# Altium schematic sheet ProExtBus.SchDoc
size A
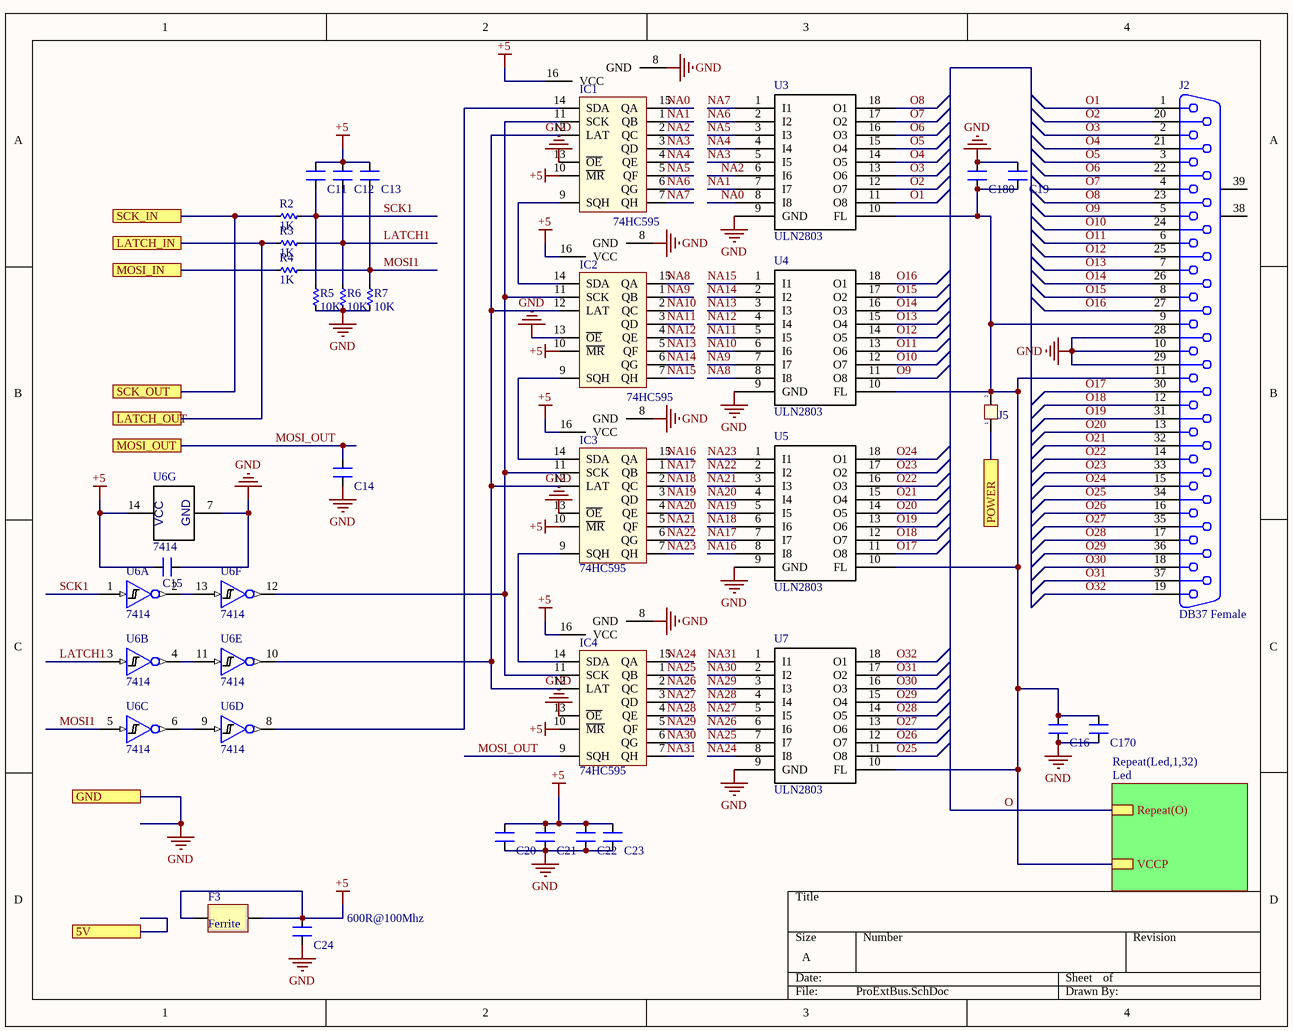
[diagram p0: ProExtBus.SchDoc]

## Parts
C11  1nF  [CN-SMD-0603_big]  (value not drawn)
C12  1nF  [CN-SMD-0603_big]  (value not drawn)
C13  1nF  [CN-SMD-0603_big]  (value not drawn)
C14  1nF  [CN-SMD-0603_big]  (value not drawn)
C15  CN  [CN-SMD-0603_big]  (value not drawn)
C16  CN  [CN-SMD-0603_big]  (value not drawn)
C19  CN  [CN-SMD-0603_big]  (value not drawn)
C20  CN  [CN-SMD-0603_big]  (value not drawn)
C21  CN  [CN-SMD-0603_big]  (value not drawn)
C22  CN  [CN-SMD-0603_big]  (value not drawn)
C23  CN  [CN-SMD-0603_big]  (value not drawn)
C24  CN  [CN-SMD-0603_big]  (value not drawn)
C170  CN  [CN-SMD-0603_big]  (value not drawn)
C180  CN  [CN-SMD-0603_big]  (value not drawn)
F3  600R@100Mhz  [Capacitor_805]
IC1  74HC595  [SO16]
IC2  74HC595  [SO16]
IC3  74HC595  [SO16]
IC4  74HC595  [SO16]
J2  DB37 Female  [DB37]
J5  Jumper 2  [JP2]  (value not drawn)
R2  1K  [RES-SMD-0603_BIG]
R3  1K  [RES-SMD-0603_BIG]
R4  1K  [RES-SMD-0603_BIG]
R5  10K  [RES-SMD-0603_BIG]
R6  10K  [RES-SMD-0603_BIG]
R7  10K  [RES-SMD-0603_BIG]
U3  ULN2803  [SO18]
U4  ULN2803  [SO18]
U5  ULN2803  [SO18]
U6  7414  [SO14]  (parts A,B,C,D,E,F,G of 7)
U7  ULN2803  [SO18]

## Sub-sheets
Repeat(Led,1,32) = Led: Repeat(O), VCCP

## Ports
5V, GND, LATCH_IN, LATCH_OUT, MOSI_IN, MOSI_OUT, POWER, SCK_IN, SCK_OUT

## Nets
+5: C11.2 C12.2 C13.2 C15.1 C20.2 C21.2 C22.2 C23.2 C24.2 F3.1 F3.2 IC1.10(~{MR}) IC1.16(VCC) IC2.10(~{MR}) IC2.16(VCC) IC3.10(~{MR}) IC3.16(VCC) IC4.10(~{MR}) IC4.16(VCC) U6.14(VCC)  [also labelled VCC]
GND: C14.1 C15.2 C16.1 C19.2 C20.1 C21.1 C22.1 C23.1 C24.1 C170.1 C180.2 IC1.8(GND) IC1.13(~{OE}) IC2.8(GND) IC2.13(~{OE}) IC3.8(GND) IC3.13(~{OE}) IC4.8(GND) IC4.13(~{OE}) J2.10 J2.28 J2.29 R5.2 R6.2 R7.2 U3.9(GND) U4.9(GND) U5.9(GND) U6.7(GND) U7.9(GND) ; port GND
LATCH1: C12.1 R3.1 R6.1 U6.3(A)
LATCH_IN: R3.2 ; port LATCH_IN, port LATCH_OUT
MOSI1: C13.1 R4.1 R7.1 U6.5(A)
MOSI_IN: R4.2 ; port MOSI_IN
MOSI_OUT: C14.2 IC4.9(SQH) ; port MOSI_OUT
NA0: IC1.15(QA) U3.8(I8)
NA1: IC1.1(QB) U3.7(I7)
NA2: IC1.2(QC) U3.6(I6)
NA3: IC1.3(QD) U3.5(I5)
NA4: IC1.4(QE) U3.4(I4)
NA5: IC1.5(QF) U3.3(I3)
NA6: IC1.6(QG) U3.2(I2)
NA7: IC1.7(QH) U3.1(I1)
NA8: IC2.15(QA) U4.8(I8)
NA9: IC2.1(QB) U4.7(I7)
NA10: IC2.2(QC) U4.6(I6)
NA11: IC2.3(QD) U4.5(I5)
NA12: IC2.4(QE) U4.4(I4)
NA13: IC2.5(QF) U4.3(I3)
NA14: IC2.6(QG) U4.2(I2)
NA15: IC2.7(QH) U4.1(I1)
NA16: IC3.15(QA) U5.8(I8)
NA17: IC3.1(QB) U5.7(I7)
NA18: IC3.2(QC) U5.6(I6)
NA19: IC3.3(QD) U5.5(I5)
NA20: IC3.4(QE) U5.4(I4)
NA21: IC3.5(QF) U5.3(I3)
NA22: IC3.6(QG) U5.2(I2)
NA23: IC3.7(QH) U5.1(I1)
NA24: IC4.15(QA) U7.8(I8)
NA25: IC4.1(QB) U7.7(I7)
NA26: IC4.2(QC) U7.6(I6)
NA27: IC4.3(QD) U7.5(I5)
NA28: IC4.4(QE) U7.4(I4)
NA29: IC4.5(QF) U7.3(I3)
NA30: IC4.6(QG) U7.2(I2)
NA31: IC4.7(QH) U7.1(I1)
O: sheet Repeat(Led,1,32)/Repeat(O)
O1: J2.1 U3.11(O8)
O2: J2.20 U3.12(O7)
O3: J2.2 U3.13(O6)
O4: J2.21 U3.14(O5)
O5: J2.3 U3.15(O4)
O6: J2.22 U3.16(O3)
O7: J2.4 U3.17(O2)
O8: J2.23 U3.18(O1)
O9: J2.5 U4.11(O8)
O10: J2.24 U4.12(O7)
O11: J2.6 U4.13(O6)
O12: J2.25 U4.14(O5)
O13: J2.7 U4.15(O4)
O14: J2.26 U4.16(O3)
O15: J2.8 U4.17(O2)
O16: J2.27 U4.18(O1)
O17: J2.30 U5.11(O8)
O18: J2.12 U5.12(O7)
O19: J2.31 U5.13(O6)
O20: J2.13 U5.14(O5)
O21: J2.32 U5.15(O4)
O22: J2.14 U5.16(O3)
O23: J2.33 U5.17(O2)
O24: J2.15 U5.18(O1)
O25: J2.34 U7.11(O8)
O26: J2.16 U7.12(O7)
O27: J2.35 U7.13(O6)
O28: J2.17 U7.14(O5)
O29: J2.36 U7.15(O4)
O30: J2.18 U7.16(O3)
O31: J2.37 U7.17(O2)
O32: J2.19 U7.18(O1)
POWER: J5.1 ; port POWER
SCK1: C11.1 R2.1 R5.1 U6.1(A)
SCK_IN: R2.2 ; port SCK_IN, port SCK_OUT
NetC16_2: C16.2 C19.1 C170.2 C180.1 J2.9 J2.11 J5.2 U3.10(FL) U4.10(FL) U5.10(FL) U7.10(FL) ; sheet Repeat(Led,1,32)/VCCP
NetIC1_9: IC1.9(SQH) IC2.14(SDA)
NetIC1_11: IC1.11(SCK) IC2.11(SCK) IC3.11(SCK) IC4.11(SCK) U6.12(Y)
NetIC1_12: IC1.12(LAT) IC2.12(LAT) IC3.12(LAT) IC4.12(LAT) U6.10(Y)
NetIC1_14: IC1.14(SDA) U6.8(Y)
NetIC2_9: IC2.9(SQH) IC3.14(SDA)
NetIC3_9: IC3.9(SQH) IC4.14(SDA)
NetU6_2: U6.2(Y) U6.13(A)
NetU6_4: U6.4(Y) U6.11(A)
NetU6_6: U6.6(Y) U6.9(A)

Not connected (* = marked no-connect by the designer): J2 38(MH1) 39(MH2)

## Library data of the parts
C11-C16 C19-C24 C170 C180 = CN: Value: 33pF
F3 = Ferrite
IC1-IC4 = 74595: 8 Bit Serial input - Parallel Output; Value: 74HC595
J5 = JP 2: Value: JP 2
R2-R7 = R
U3-U5 U7 = ULN2803: OCTAL HIGH CURRENT DRIVER; Manufacturer: Texas Instruments; Manufacturer Part Number: ULN2803ADWR; Number of Drivers/Receivers: 8/0; Voltage - Supply: 5V; Supplier 1: Digi-Key; Supplier Part Number 1: 296-15777-1-ND; Packaging: Cut Tape (CT); Supplier Part Number: 296-15777-1-ND; Type: Darlington Array; Supplier: Digi-Key; Protocol: -; Package / Case: 18-SOIC (7.5mm Width); Category: Integrated Circuits (ICs); RoHS: RoHS Compliant
U6 = 7414: IC, M74HC04M, Hex Inverter, SO-14; Text Field1: ST; Text Field2: M74HC04M1R; Text Field3: Mouser; Text Field4: 511-M74HC04M; Text Field6: .22; Text Field5: SO-14; NI?: *; O?: *; Section:: *